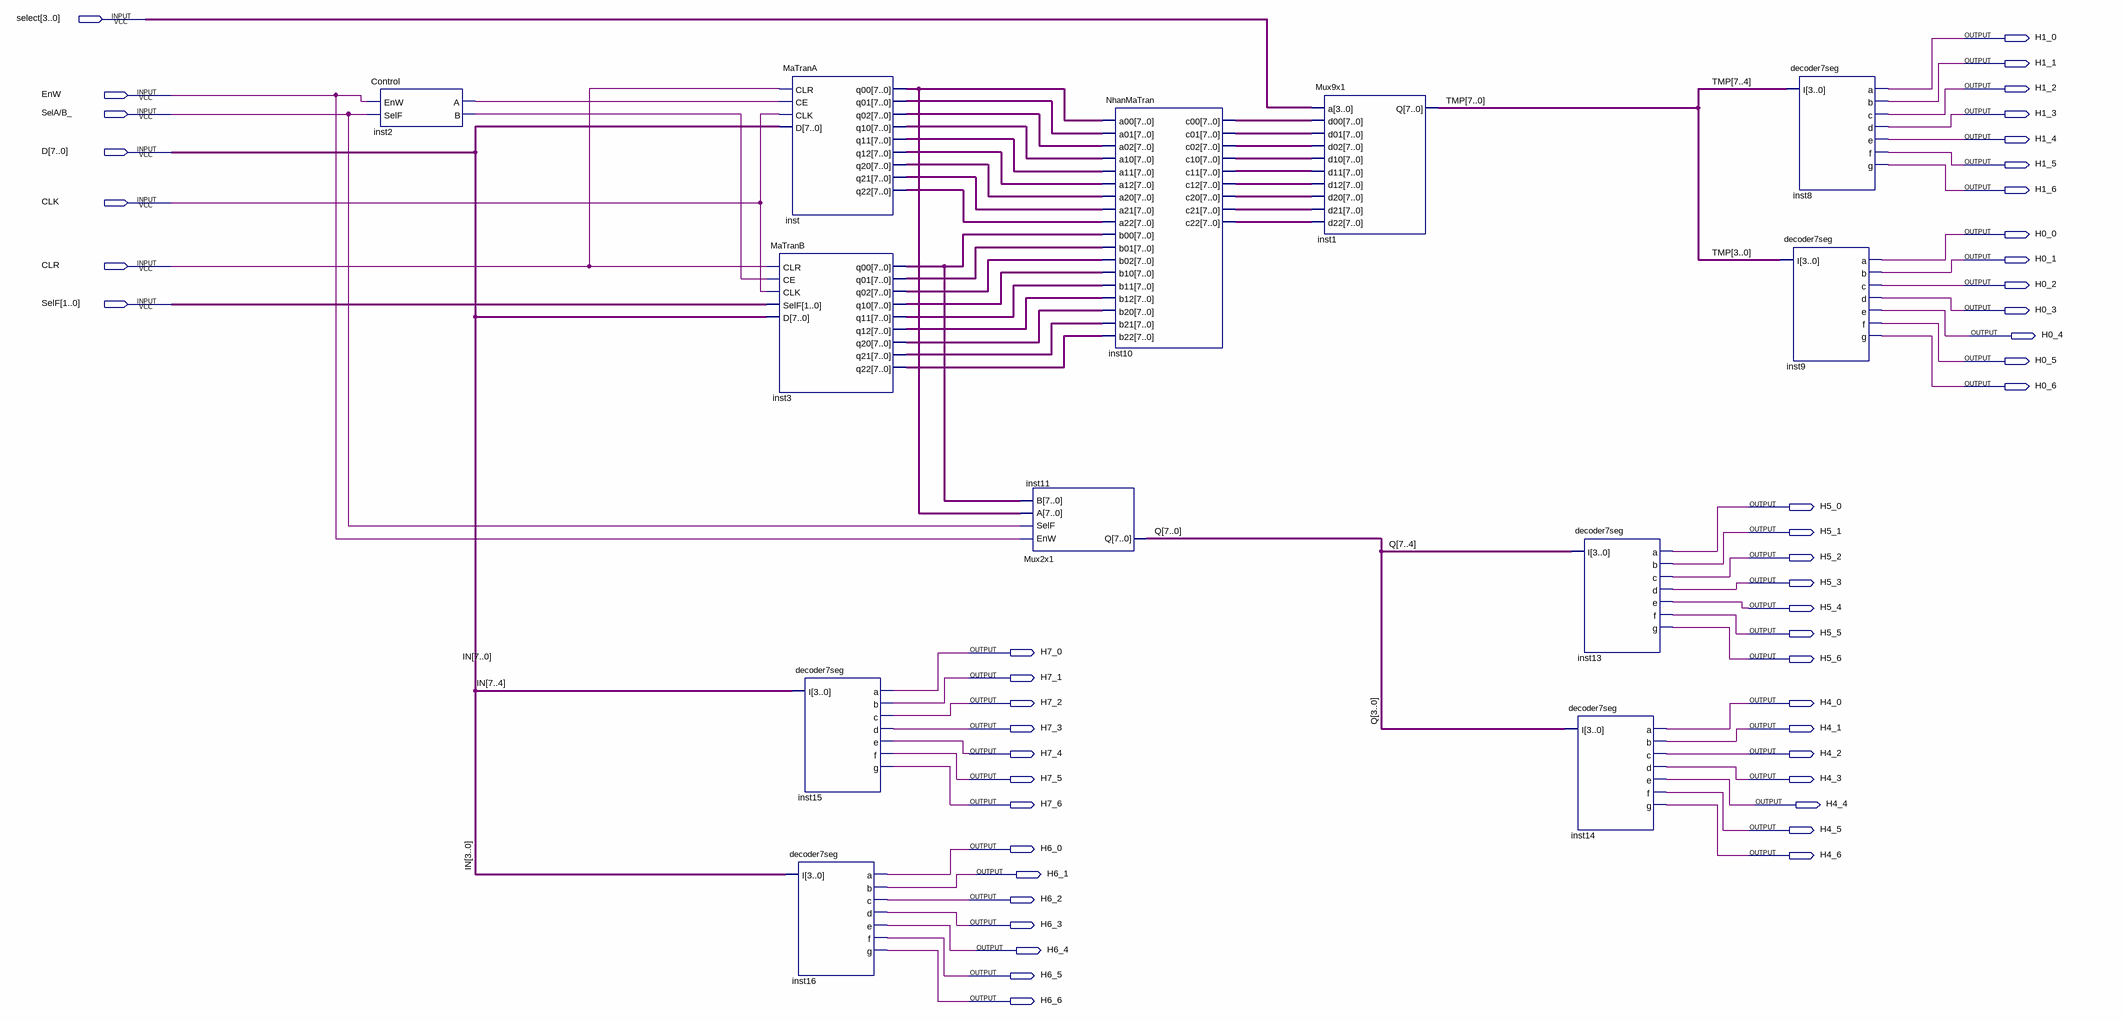
[diagram p0: schematic sheet]
// Quartus schematic FullDesign.bdf as structural Verilog: 12 symbols, 49 pins
module FullDesign (
  input  [3:0] select,
  input  EnW,
  input  \SelA/B_ ,
  input  [7:0] D,
  input  CLK,
  input  CLR,
  input  [1:0] SelF,
  output H1_0,
  output H1_1,
  output H1_2,
  output H1_3,
  output H1_4,
  output H1_5,
  output H1_6,
  output H0_0,
  output H0_1,
  output H0_2,
  output H0_3,
  output H0_4,
  output H0_5,
  output H0_6,
  output H5_0,
  output H5_1,
  output H5_2,
  output H5_3,
  output H5_4,
  output H5_5,
  output H7_0,
  output H5_6,
  output H7_1,
  output H7_2,
  output H4_0,
  output H7_3,
  output H4_1,
  output H7_4,
  output H4_2,
  output H7_5,
  output H4_3,
  output H7_6,
  output H4_4,
  output H4_5,
  output H6_0,
  output H4_6,
  output H6_1,
  output H6_2,
  output H6_3,
  output H6_4,
  output H6_5,
  output H6_6
);

  wire inst2_a, inst2_b;
  wire [7:0] inst3_q00, inst3_q01, inst3_q02, inst3_q10, inst3_q11, inst3_q12, inst3_q20, inst3_q21,
       inst3_q22, inst10_c00, inst10_c01, inst10_c02, inst10_c10, inst10_c11, inst10_c12, inst10_c20,
       inst10_c21, inst10_c22, inst_q00, inst_q01, inst_q02, inst_q10, inst_q11, inst_q12, inst_q20,
       inst_q21, inst_q22, Q, TMP;

  Control inst2 (.EnW(EnW), .SelF(\SelA/B_ ), .A(inst2_a), .B(inst2_b));
  MaTranB inst3 (
    .CLR(CLR), .CE(inst2_b), .CLK(CLK), .SelF(SelF), .D(D), .q00(inst3_q00), .q01(inst3_q01),
    .q02(inst3_q02), .q10(inst3_q10), .q11(inst3_q11), .q12(inst3_q12), .q20(inst3_q20), .q21(inst3_q21),
    .q22(inst3_q22));
  MaTranA inst (
    .CLR(CLR), .CE(inst2_a), .CLK(CLK), .D(D), .q00(inst_q00), .q01(inst_q01), .q02(inst_q02),
    .q10(inst_q10), .q11(inst_q11), .q12(inst_q12), .q20(inst_q20), .q21(inst_q21), .q22(inst_q22));
  decoder7seg inst15 (.I(D[7:4]), .a(H7_0), .b(H7_1), .c(H7_2), .d(H7_3), .e(H7_4), .f(H7_5), .g(H7_6));
  decoder7seg inst16 (.I(D[3:0]), .a(H6_0), .b(H6_1), .c(H6_2), .d(H6_3), .e(H6_4), .f(H6_5), .g(H6_6));
  Mux2x1 inst11 (.EnW(EnW), .SelF(\SelA/B_ ), .A(inst_q00), .B(inst3_q00), .Q(Q));
  NhanMaTran inst10 (
    .a00(inst_q00), .a01(inst_q01), .a02(inst_q02), .a10(inst_q10), .a11(inst_q11), .a12(inst_q12),
    .a20(inst_q20), .a21(inst_q21), .a22(inst_q22), .b00(inst3_q00), .b01(inst3_q01), .b02(inst3_q02),
    .b10(inst3_q10), .b11(inst3_q11), .b12(inst3_q12), .b20(inst3_q20), .b21(inst3_q21), .b22(inst3_q22),
    .c00(inst10_c00), .c01(inst10_c01), .c02(inst10_c02), .c10(inst10_c10), .c11(inst10_c11),
    .c12(inst10_c12), .c20(inst10_c20), .c21(inst10_c21), .c22(inst10_c22));
  Mux9x1 inst1 (
    .a(select), .d00(inst10_c00), .d01(inst10_c01), .d02(inst10_c02), .d10(inst10_c10), .d11(inst10_c11),
    .d12(inst10_c12), .d20(inst10_c20), .d21(inst10_c21), .d22(inst10_c22), .Q(TMP));
  decoder7seg inst13 (.I(Q[7:4]), .a(H5_0), .b(H5_1), .c(H5_2), .d(H5_3), .e(H5_4), .f(H5_5), .g(H5_6));
  decoder7seg inst14 (.I(Q[3:0]), .a(H4_0), .b(H4_1), .c(H4_2), .d(H4_3), .e(H4_4), .f(H4_5), .g(H4_6));
  decoder7seg inst9 (.I(TMP[3:0]), .a(H0_0), .b(H0_1), .c(H0_2), .d(H0_3), .e(H0_4), .f(H0_5), .g(H0_6));
  decoder7seg inst8 (.I(TMP[7:4]), .a(H1_0), .b(H1_1), .c(H1_2), .d(H1_3), .e(H1_4), .f(H1_5), .g(H1_6));

  // Other names for the same wires on the sheet: IN[7:0] = D
endmodule
